# Altium schematic sheet FeedbackLoop.SchDoc: Sync Demod
size Tabloid; DocumentNumber: LM-003; Revision: 3.0; SheetNumber: 2; SheetTotal: 11
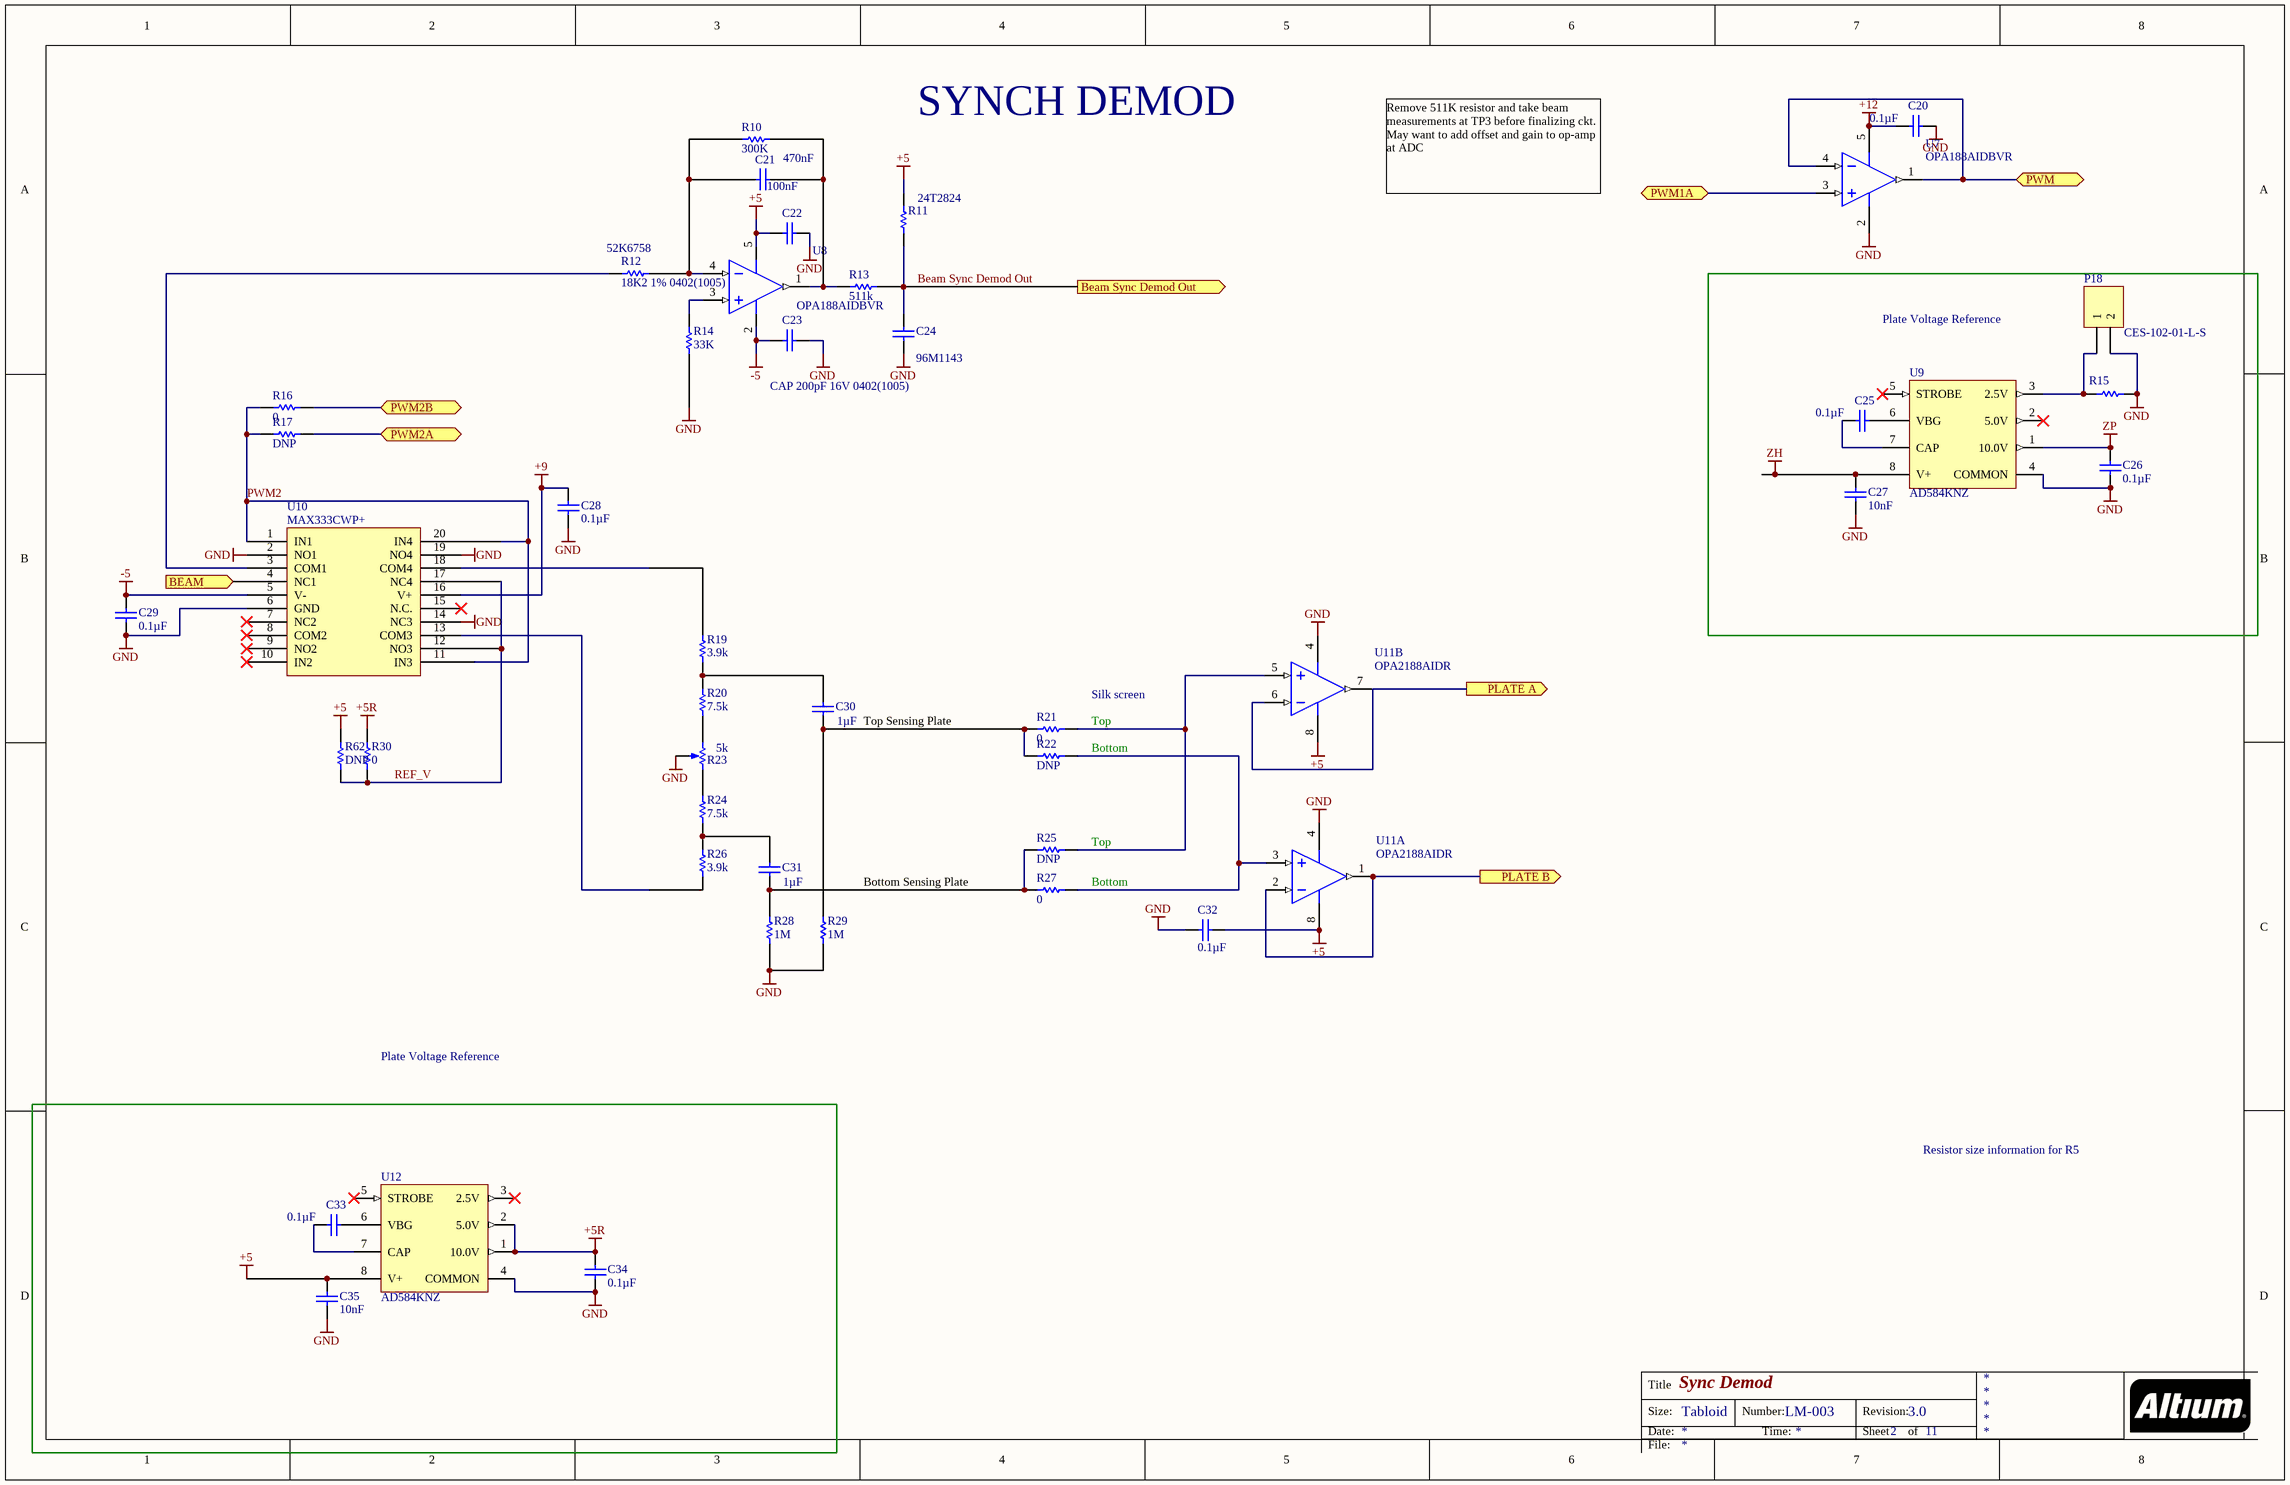
[diagram p0: FeedbackLoop.SchDoc]

## Parts
C20  Capacitance: 0.1µF  [CAPC0805(2012)100_N]  (hidden comment: CAP 100nF 25V 0805(2012))
C21  Capacitance: 470nF  [CAPC0402(1005)60_L]
C22  Capacitance: 100nF  [CAPC0402(1005)60_L]
C23  CAP 200pF 16V 0402(1005)  [CAPC0402(1005)60_L]
C24  Supplier Part Number 1: 96M1143  [CAPC0402(1005)60_L]
C25  Capacitance: 0.1µF  [CAPC0805(2012)100_N]  (hidden comment: CAP 100nF 25V 0805(2012))
C26  Capacitance: 0.1µF  [CAPC0805(2012)145_N]  (hidden comment: CAP CER 0.1UF 25V X7R 0805)
C27  Capacitance: 10nF  [CAPC0805(2012)145_N]  (hidden comment: Multilayer Ceramic Capacitors MLCC - SMD/SMT 0.01uF 50volts 10% X7R)
C28  Capacitance: 0.1µF  [CAPC0805(2012)145_N]  (hidden comment: CAP CER 0.1UF 25V X7R 0805)
C29  Capacitance: 0.1µF  [CAPC0805(2012)145_N]  (hidden comment: CAP CER 0.1UF 25V X7R 0805)
C30  Capacitance: 1µF  [CAPC0805(2012)155_L]  (hidden comment: CAP CER 1UF 25V X7R 0805)
C31  Capacitance: 1µF  [CAPC0805(2012)155_L]  (hidden comment: CAP CER 1UF 25V X7R 0805)
C32  Capacitance: 0.1µF  [CAPC0805(2012)155_L]  (hidden comment: CAP CER 0.1UF 25V X7R 0805)
C33  Capacitance: 0.1µF  [CAPC0805(2012)100_N]  (hidden comment: CAP 100nF 25V 0805(2012))
C34  Capacitance: 0.1µF  [CAPC0805(2012)145_N]  (hidden comment: CAP CER 0.1UF 25V X7R 0805)
C35  Capacitance: 10nF  [CAPC0805(2012)145_N]  (hidden comment: Multilayer Ceramic Capacitors MLCC - SMD/SMT 0.01uF 50volts 10% X7R)
P18  LOW PROFILE .025" SQUARE STRIPS  [CES-102-01-L-S]  (value not drawn)
R10  300K  [RESC0402(1005)_M]
R11  Supplier Part Number 1: 24T2824  [RESC0402(1005)_M]
R12  18K2 1% 0402(1005)  Supplier Part Number 1: 52K6758  [RESC0402(1005)_M]
R13  511k  [RESC0402(1005)_M]
R14  33K  [RESC0402(1005)_M]
R15  TBD  [VH102K]  (value not drawn)
R16  0  [RESC0402(1005)_M]
R17  DNP  [RESC0402(1005)_M]
R19  3.9k  [RESC0402(1005)_M]
R20  7.5k  [RESC0402(1005)_M]
R21  0  [RESC0402(1005)_M]
R22  DNP  [RESC0402(1005)_M]
R23  Resistance (Ohms): 5k  [Trimmer 2.54]  (hidden comment: TRIMMER 5K OHM 0.25W PC PIN)
R24  7.5k  [RESC0402(1005)_M]
R25  DNP  [RESC0402(1005)_M]
R26  3.9k  [RESC0402(1005)_M]
R27  0  [RESC0402(1005)_M]
R28  1M  [RESC0402(1005)_M]
R29  1M  [RESC0402(1005)_M]
R30  0  [RESC0402(1005)_M]
R62  DNP  [RESC0402(1005)_M]
U7  OPA188AIDBVR  [DBV0005A_M]
U8  OPA188AIDBVR  [DBV0005A_M]
U9  AD584KNZ  [ADI-N-8]
U10  MAX333CWP+  [TSOP65P640X90-20N]
U11  OPA2188AIDR  [D0008A_L]  (parts A,B of 2)
U12  AD584KNZ  [ADI-N-8]

## Blocks framed on the sheet
Plate Voltage Reference: C25-C27 P18 R15 U9

## Ports
BEAM (in), Beam Sync Demod Out (out), PLATE A (out), PLATE B (out), PWM, PWM1A, PWM2A, PWM2B

## Nets
+5: C22.1 C32.1 C35.1 R11.2 R62.2 U8.5(V+) U11.8(V+) U12.8(V+)
+5R: C34.1 R30.2 U12.1(10.0V) U12.2(5.0V)
+9: C28.2 U10.16(V+)
+12: C20.1 U7.5(V+)
-5: C23.1 C29.1 U8.2(V-) U10.5(V-)
GND: C20.2 C22.2 C23.2 C24.1 C26.2 C27.2 C28.1 C29.2 C32.2 C34.2 C35.2 P18.2 R14.1 R15.2 R23.2(b) R28.1 R29.1 U7.2(V-) U9.4(COMMON) U10.2(NO1) U10.6(GND) U10.14(NC3) U10.19(NO4) U11.4(V-) U12.4(COMMON)
ZH: C27.1 U9.8(V+)
ZP: C26.1 U9.1(10.0V)
BEAM: U10.4(NC1) ; port BEAM
Beam Sync Demod Out: C24.2 R11.1 R13.2 ; port Beam Sync Demod Out
PLATE A: U11.6(IN_B-) ; port PLATE A
PLATE B: U11.1(OUT_A) U11.2(IN_A-) ; port PLATE B
PWM: U7.1(OUT) U7.4(IN-) ; port PWM
PWM1A: U7.3(IN+) ; port PWM1A
PWM2: R16.2 R17.2 U10.1(IN1) U10.11(IN3) U10.20(IN4)
PWM2A: R17.1 ; port PWM2A
PWM2B: R16.1 ; port PWM2B
REF_V: R30.1 R62.1 U10.12(NO3) U10.17(NC4)
NetC21_1: C21.1 R10.1 R12.2 U8.4(IN-)
NetC21_2: C21.2 R10.2 R13.1 U8.1(OUT)
NetC25_1: C25.1 U9.7(CAP)
NetC25_2: C25.2 U9.6(VBG)
NetC30_1: C30.1 R21.2 R22.2 R29.2
NetC30_2: C30.2 R19.1 R20.2
NetC31_1: C31.1 R25.2 R27.2 R28.2
NetC31_2: C31.2 R24.1 R26.2
NetC33_1: C33.1 U12.7(CAP)
NetC33_2: C33.2 U12.6(VBG)
NetP18_1: P18.1 R15.1 U9.3(2.5V)
NetR12_1: R12.1 U10.3(COM1)
NetR14_2: R14.2 U8.3(IN+)
NetR19_2: R19.2 U10.18(COM4)
NetR20_1: R20.1 R23.3(c)
NetR21_1: R21.1 R25.1 U11.5(IN_B+)
NetR22_1: R22.1 R27.1 U11.3(IN_A+)
NetR23_1: R23.1(a) R24.2
NetR26_1: R26.1 U10.13(COM3)

Not connected (* = marked no-connect by the designer): U9 2(5.0V)* 5(STROBE)*; U10 7(NC2)* 8(COM2)* 9(NO2)* 10(IN2)* 15(N.C.)*; U11 7(OUT_B); U12 3(2.5V)* 5(STROBE)*

## Notes on the sheet
- SYNCH DEMOD
- Remove 511K resistor and take beam measurements at TP3 before finalizing ckt.
  May want to add offset and gain to op-amp at ADC
- Silk screen
- (near C30) Top Sensing Plate
- Top
- Bottom
- Bottom Sensing Plate
- (near R25) Top
- Plate Voltage Reference
- Resistor size information for R5
- Title
- Size:
- Date:
- Tabloid
- Number:
- Time:
- Revision:
- Sheet
- of
- File:

## Library data of the parts
C20 C25 C33 = CMP-1036-04416-1: CAP 100nF 25V -20% to +80% 0805 (2012 Metric) Thickness 1mm SMD; Manufacturer: Murata Electronics North America; Manufacturer Part Number: GRM21BR71E104KA01L; Tolerance: ±10%; Temperature Coefficient: X7R; Supplier 1: Digi-Key; Supplier Part Number 1: 490-1673-1-ND; RoHS: RoHS Compliant; Category: Capacitors; Stock 1: 895391; Pricing 1: 1=0.2, 10=0.145, 100=0.0683, 500=0.04788, 1000=0.03964 (USD); Packaging: Cut Tape (CT); Part Status: Active; Voltage - Rated: 25V; Operating Temperature: -55°C ~ 125°C; Features: -; Ratings: -; Applications: General Purpose; Mounting Type: Surface Mount, MLCC; Package / Case: 0805 (2012 Metric); Size / Dimension: 0.079" L x 0.049" W (2.00mm x 1.25mm); Height - Seated (Max): -; Thickness (Max): 0.053" (1.35mm); Lead Spacing: -; Lead Style: -; ComponentLink1URL: http://www.murata.com/~/media/webrenewal/support/library/catalog/products/capacitor/mlcc/c02e.ashx; ComponentLink1Description: http://www.murata.com/~/media/webrenewal/support/library/catalog/products/capacitor/mlcc/c02e.ashx
C21 = CMP-1034-01343-1: Manufacturer: TDK; Manufacturer Part Number: C1005X5R1E474M050BB; Dielectric Material: Ceramic; Tolerance: 20%; Voltage Rating: 25V; Dielectric: X5R; Supplier 1: Mouser; Supplier Part Number 1: 810-C1005X5R1E474M; Stock 1: 40105; Pricing 1: 1=0.15, 10=0.101, 50=0.101, 100=0.04, 1000=0.028, 10000=0.023 (USD); Mount: Surface Mount; Case/Package: 0402; Weight: 2.3E-05oz; Case Code (Metric): 1005; Case Code (Imperial): 0402; Min Operating Temperature: -55°C; Max Operating Temperature: 85°C; Package Quantity: 10000; Packaging: Tape and Reel; Voltage Rating (DC): 25V; Termination: SMD/SMT; Composition: Ceramic; Length: 1mm; Height: 0.5mm; Width: 0.02inch; Depth: 0.5mm; Thickness: 500um; Radiation Hardening: No; REACH SVHC: No SVHC; Lead Free: Lead Free; ComponentLink1URL: https://datasheet.ciiva.com/26870/getdatasheetpartid-753870-26870164.pdf; ComponentLink1Description: https://datasheet.ciiva.com/26870/getdatasheetpartid-753870-26870164.pdf; ComponentLink2URL: https://datasheet.ciiva.com/24219/mlcc-commercial-general-en-24219290.pdf; ComponentLink2Description: https://datasheet.ciiva.com/24219/mlcc-commercial-general-en-24219290.pdf
C22 = CMP-1034-01343-1: Manufacturer: Kemet; Manufacturer Part Number: C0402C104K4RACAUTO; Dielectric Material: Ceramic; Tolerance: 10%; Voltage Rating: 16V; Dielectric: X7R; Dissipation Factor: 3.5%; Supplier 1: Mouser; Supplier Part Number 1: 80-C0402C104K4RAUTO; Stock 1: 120173; Pricing 1: 1=0.1, 10=0.07, 50=0.07, 100=0.07, 1000=0.059, 10000=0.042 (USD); Mount: Surface Mount; Case/Package: 0402; Case Code (Imperial): 0402; Case Code (Metric): 1005; Min Operating Temperature: -55°C; Max Operating Temperature: 125°C; Packaging: Tape and Reel; Package Quantity: 10000; Voltage Rating (DC): 16V; Termination: SMD/SMT; Length: 1mm; Height: 0.5mm; Width: 0.5mm; Thickness: 0.022inch; Depth: 0.5mm; Radiation Hardening: No; REACH SVHC: No SVHC; ComponentLink1URL: https://datasheet.ciiva.com/6254/datasheetpn-c0402c104k4racauto-6254625.pdf; ComponentLink1Description: https://datasheet.ciiva.com/6254/datasheetpn-c0402c104k4racauto-6254625.pdf; ComponentLink2URL: https://datasheet.ciiva.com/5999/1730444-5999370.pdf; ComponentLink2Description: https://datasheet.ciiva.com/5999/1730444-5999370.pdf; ComponentLink3URL: https://datasheet.ciiva.com/7747/1730444-7747437.pdf; ComponentLink3Description: https://datasheet.ciiva.com/7747/1730444-7747437.pdf; ComponentLink4URL: https://datasheet.ciiva.com/22693/1730444-22693870.pdf; ComponentLink4Description: https://datasheet.ciiva.com/22693/1730444-22693870.pdf
C23 = CMP-1034-01343-1: CAP 200pF 16V ±2% 0402 (1005 Metric) Thickness 0.6mm SMD; Manufacturer: Kemet; Manufacturer Part Number: C0402C104K4RACAUTO; Case-EIA: 0402; Case-Metric: 1005; Tolerance: Â±2%; Dielectric Material: Ceramic; Capacitance: 100nF; Dielectric: X7R; Dissipation Factor: 3.5%; Value: 200pF; Technology: SMT; Rated Voltage: 16 V; Max Thickness: 0.6 mm; Supplier 1: Mouser; Supplier Part Number 1: 80-C0402C104K4RAUTO; Stock 1: 120173; Pricing 1: 1=0.1, 10=0.07, 50=0.07, 100=0.07, 1000=0.059, 10000=0.042 (USD); Mount: Surface Mount; Case/Package: 0402; Case Code (Imperial): 0402; Case Code (Metric): 1005; Min Operating Temperature: -55°C; Max Operating Temperature: 125°C; Voltage Rating: 16V; Packaging: Tape and Reel; Package Quantity: 10000; Voltage Rating (DC): 16V; Termination: SMD/SMT; Length: 1mm; Height: 0.5mm; Width: 0.5mm; Thickness: 0.022inch; Depth: 0.5mm; Radiation Hardening: No; REACH SVHC: No SVHC; ComponentLink1URL: https://datasheet.ciiva.com/6254/datasheetpn-c0402c104k4racauto-6254625.pdf; ComponentLink1Description: https://datasheet.ciiva.com/6254/datasheetpn-c0402c104k4racauto-6254625.pdf; ComponentLink2URL: https://datasheet.ciiva.com/5999/1730444-5999370.pdf; ComponentLink2Description: https://datasheet.ciiva.com/5999/1730444-5999370.pdf; ComponentLink3URL: https://datasheet.ciiva.com/7747/1730444-7747437.pdf; ComponentLink3Description: https://datasheet.ciiva.com/7747/1730444-7747437.pdf; ComponentLink4URL: https://datasheet.ciiva.com/22693/1730444-22693870.pdf; ComponentLink4Description: https://datasheet.ciiva.com/22693/1730444-22693870.pdf
C24 = CMP-1034-01343-1: Manufacturer: AVX; Manufacturer Part Number: 04025A220JAT2A; Ceramic Capacitor Case: 0402 [1005 Metric]; Capacitance: 22; Voltage Rating: 50; Capacitance Tolerance: 5%; Dielectric Characteristic: C0G / NP0; Supplier 1: Newark; RoHS: YES; Stock 1: 239391; Pricing 1: 1=0.003, 25=0.003, 100=0.003, 250=0.003, 500=0.003, 1000=0.003, 2500=0.003 (USD); Product Range: -; Packaging: Cut Tape; ComponentLink1URL: http://www.farnell.com/datasheets/2068140.pdf; ComponentLink1Description: http://www.farnell.com/datasheets/2068140.pdf
C26 C28 C29 C34 = CMP-1036-04795-1: Manufacturer: Murata Electronics North America; Manufacturer Part Number: GRM21BR71E104KA01L; Tolerance: ±10%; Supplier 1: Digi-Key; Supplier Part Number 1: 490-1673-6-ND; RoHS: RoHS Compliant; Category: Capacitors; Stock 1: 891652; Pricing 1: 1=0.2, 10=0.145, 100=0.0683, 500=0.04788, 1000=0.03964 (USD); Packaging: Digi-Reel®; Part Status: Active; Voltage - Rated: 25V; Temperature Coefficient: X7R; Operating Temperature: -55°C ~ 125°C; Features: -; Ratings: -; Applications: General Purpose; Mounting Type: Surface Mount, MLCC; Package / Case: 0805 (2012 Metric); Size / Dimension: 0.079" L x 0.049" W (2.00mm x 1.25mm); Height - Seated (Max): -; Thickness (Max): 0.053" (1.35mm); Lead Spacing: -; Lead Style: -; ComponentLink1URL: http://www.murata.com/~/media/webrenewal/support/library/catalog/products/capacitor/mlcc/c02e.ashx; ComponentLink1Description: http://www.murata.com/~/media/webrenewal/support/library/catalog/products/capacitor/mlcc/c02e.ashx
C27 C35 = CMP-1036-04795-1: Manufacturer: Kemet; Manufacturer Part Number: C0805C103K5RACAUTO; Voltage Rating: 50V; Supplier 1: Digi-Key; Supplier Part Number 1: 399-6924-1-ND; Stock 1: 63236; Pricing 1: 1=0.12, 10=0.087, 100=0.041, 500=0.0287, 1000=0.0238 (USD); Mount: Surface Mount; Case/Package: 0805; Case Code (Metric): 2012; Case Code (Imperial): 0805; Dielectric Material: Ceramic; Contact Plating: Tin; Min Operating Temperature: -55°C; Max Operating Temperature: 125°C; Tolerance: 10%; Packaging: Tape and Reel; Package Quantity: 1; Voltage Rating (DC): 50V; Dielectric: X7R; Termination: SMD/SMT; Length: 2mm; Height: 0.78mm; Width: 0.049inch; Thickness: 0.035inch; Depth: 1.25mm; Radiation Hardening: No; REACH SVHC: No SVHC; ComponentLink1URL: https://datasheet.ciiva.com/22700/1693454-22700519.pdf; ComponentLink1Description: https://datasheet.ciiva.com/22700/1693454-22700519.pdf; ComponentLink2URL: https://datasheet.ciiva.com/7842/1693454-7842175.pdf; ComponentLink2Description: https://datasheet.ciiva.com/7842/1693454-7842175.pdf
C30 C31 = CMP-1036-04882-1: Manufacturer: Murata Electronics North America; Manufacturer Part Number: GRM21BR71E105KA99L; Tolerance: ±10%; Supplier 1: Digi-Key; Supplier Part Number 1: 490-6484-6-ND; RoHS: RoHS Compliant; Category: Capacitors; Stock 1: 295074; Pricing 1: 1=0.14, 10=0.099, 100=0.0468, 500=0.0328, 1000=0.02715 (USD); Packaging: Digi-Reel®; Part Status: Active; Voltage - Rated: 25V; Temperature Coefficient: X7R; Operating Temperature: -55°C ~ 125°C; Features: -; Ratings: -; Applications: General Purpose; Mounting Type: Surface Mount, MLCC; Package / Case: 0805 (2012 Metric); Size / Dimension: 0.079" L x 0.049" W (2.00mm x 1.25mm); Height - Seated (Max): -; Thickness (Max): 0.053" (1.35mm); Lead Spacing: -; Lead Style: -; ComponentLink1URL: http://www.murata.com/~/media/webrenewal/support/library/catalog/products/capacitor/mlcc/c02e.ashx; ComponentLink1Description: http://www.murata.com/~/media/webrenewal/support/library/catalog/products/capacitor/mlcc/c02e.ashx
C32 = CMP-1036-04882-1: Manufacturer: Murata Electronics North America; Manufacturer Part Number: GRM21BR71E104KA01L; Tolerance: ±10%; Supplier 1: Digi-Key; Supplier Part Number 1: 490-1673-6-ND; RoHS: RoHS Compliant; Category: Capacitors; Stock 1: 891652; Pricing 1: 1=0.2, 10=0.145, 100=0.0683, 500=0.04788, 1000=0.03964 (USD); Packaging: Digi-Reel®; Part Status: Active; Voltage - Rated: 25V; Temperature Coefficient: X7R; Operating Temperature: -55°C ~ 125°C; Features: -; Ratings: -; Applications: General Purpose; Mounting Type: Surface Mount, MLCC; Package / Case: 0805 (2012 Metric); Size / Dimension: 0.079" L x 0.049" W (2.00mm x 1.25mm); Height - Seated (Max): -; Thickness (Max): 0.053" (1.35mm); Lead Spacing: -; Lead Style: -; ComponentLink1URL: http://www.murata.com/~/media/webrenewal/support/library/catalog/products/capacitor/mlcc/c02e.ashx; ComponentLink1Description: http://www.murata.com/~/media/webrenewal/support/library/catalog/products/capacitor/mlcc/c02e.ashx
P18 = Header 2: Manufacturer: Samtec Inc.; Connector Type: Receptacle; Style: Board to Board; Number of Positions: 2; Number of Positions Loaded: All; Pitch - Mating: 0.100" (2.54mm); Contact Length - Post: 0.128" (3.25mm); Material Flammability Rating: UL94 V-0; Supplier 1: Digi-Key; Supplier Part Number 1: CES-102-01-L-S-ND; Manufacturer Part Number: CES-102-01-L-S; RoHS: RoHS Compliant; Category: Connectors, Interconnects; Stock 1: 0; Pricing 1: 1=0.61 (USD); Packaging: Bulk; Part Status: Active; Contact Type: Female Socket; Number of Rows: 1; Row Spacing - Mating: -; Mounting Type: Through Hole; Termination: Solder; Fastening Type: Push-Pull; Contact Finish - Mating: Gold; Contact Finish Thickness - Mating: 10µin (0.25µm); Insulation Color: Black; Insulation Height: 0.200" (5.08mm); Operating Temperature: -55°C ~ 125°C; Contact Finish - Post: Tin; Mated Stacking Heights: -; Ingress Protection: -; Features: -; Current Rating: -; Voltage Rating: -; Applications: -; Insulation Material: Polybutylene Terephthalate (PBT); Contact Shape: Square; Contact Material: Phosphor Bronze; Contact Finish Thickness - Post: -; ComponentLink1URL: http://suddendocs.samtec.com/prints/ces-1xx-xx-x-s-xx-mkt.pdf; ComponentLink1Description: http://suddendocs.samtec.com/prints/ces-1xx-xx-x-s-xx-mkt.pdf
R10 R13 R14 R16 R17 R19-R22 R24-R30 R62 = CMP-1011-00651-1
R11 = CMP-1011-00651-1: Manufacturer: VISHAY; Manufacturer Part Number: CRCW0402100KFKEDHP; Supplier 1: Newark; Stock 1: 0; Pricing 1: 10000=0.014, 20000=0.012 (USD); ComponentLink1URL: http://www.farnell.com/datasheets/2140397.pdf; ComponentLink1Description: http://www.farnell.com/datasheets/2140397.pdf
R12 = CMP-1011-00651-1: 18K2 0.063W 1% 0402 (1005 Metric)  SMD; Manufacturer: VISHAY; Manufacturer Part Number: CRCW040218K2FKED; Resistance: 18.2; Voltage Rating: 50; Resistor Case Style: 0402 [1005 Metric]; Power Rating: 63; Product Range: CRCW Series; No. of Pins: 2; Supplier 1: Newark; RoHS: YESX; Stock 1: 9263; Pricing 1: 1=0.004, 25=0.004, 100=0.004, 250=0.004, 500=0.004, 1000=0.004 (USD); Resistance Tolerance: 1%; Packaging: Cut Tape; ComponentLink1URL: http://www.vishay.com/docs/31543/packsmre.pdf; ComponentLink1Description: http://www.vishay.com/docs/31543/packsmre.pdf; ComponentLink2URL: http://www.farnell.com/cad/1551401.zip; ComponentLink2Description: http://www.farnell.com/cad/1551401.zip; ComponentLink3URL: http://www.farnell.com/datasheets/2111203.pdf?_ga=1.39057253.733356815.1493180800; ComponentLink3Description: http://www.farnell.com/datasheets/2111203.pdf?_ga=1.39057253.733356815.1493180800
R15 = CMP-1013-00393-1
R23 = Trimmer: Manufacturer: Vishay Foil Resistors (Division of Vishay Precision Group); Manufacturer Part Number: Y00535K00000J0L; Power (Watts): 0.25W, 1/4W; Tolerance: ±5%; Temperature Coefficient: ±10ppm/°C; Number of Turns: 21; Adjustment Type: Side Adjustment; Resistive Material: Metal Foil; Supplier 1: Digi-Key; Supplier Part Number 1: 804-1020-ND; RoHS: RoHS Compliant; Category: Potentiometers, Variable Resistors; Stock 1: 679; Pricing 1: 1=34.42, 10=32.265, 25=26.5292, 50=22.944, 100=22.227, 250=20.793, 500=19.2156 (USD); Packaging: Bulk; Part Status: Active; Mounting Type: Through Hole; Termination Style: PC Pins; Size / Dimension: Rectangular - 0.250" x 0.175" Face x 0.250" L (6.35mm x 4.45mm x 6.35mm); ComponentLink1URL: http://www.vishaypg.com/docs/63053/1240.pdf; ComponentLink1Description: http://www.vishaypg.com/docs/63053/1240.pdf
U7 U8 = CMP-0809-00005-2: Precision, Low Noise, Rail-to-Rail Output, Zero-Drift Operational Amplifier, 4 to 36 V, -40 to 125 degC, 5-pin SOT23 (DBV5), Green (RoHS & no Sb/Br); Manufacturer: Texas Instruments; Total Supply Voltage(Min)(+5V is 5, +/-5V is 10): 4; Offset Drift(Typ)(uV/C): 0.03; Rating: Catalog; SubFamily: Zero Drift Precision Amplifier; GBW(Typ)(MHz): 2; Slew Rate(Typ)(V/us): 0.8; Number of Channels: 1; CMRR(Min)(dB): 120; Iq per channel(Max)(mA): 0.51; Total Supply Voltage(Max)(+5V is 5, +/-5V is 10): 36; PartNumber: OPA188AIDBVR; ComponentLink2Description: Datasheet; ComponentLink2URL: http://www.ti.com/lit/ds/symlink/opa188.pdf; ComponentLink1Description: Manufacturer URL; Mounting Technology: Surface Mount; Eco-Plan: Green (RoHS & no Sb/Br); ComponentLink1URL: http://www.ti.com/; PackageVersion: 4073253-4/K, 03/2006; DatasheetVersion: SBOS642A; ComponentLink3Description: Package Specification; PackageReference: DBV0005A; ComponentLink3URL: http://www.ti.com/litv/pdf/mpds018i; PackageDescription: 5-Pin Plastic Small Outline, Body 1.6 x 2.9 mm, Pitch 0.95 mm; Code_JEDEC: MO-178
U9 U12 = CMP-0784-00054-1: Pin Programmable, Precision Voltage Reference, + 2.5 / + 5 / + 7.5 / + 10 Prog V Output, 4.5 to 30 V Supply, Commercial, 8-pin DIP (N-8), Tube; Manufacturer: Analog Devices; Max V Supply (V): 30; Min V Supply (V): 4.5; Ref Out TC (ppm/C): 15; Vout: 2.5V, 5V, 7.5V, 10V; ComponentLink3URL: http:/www.analog.com/static/imported-files/packages/PKG_PDF/PDIP(N)/N_8.pdf; ComponentLink1URL: http://www.analog.com/en/index.html; PartNumber: AD584KNZ; ComponentLink1Description: Manufacturer URL; ComponentLink2Description: Datasheet; PackageDescription: 8-Pin Plastic Dual In-Line Package, Row spacing 7.62 mm, Pitch 2.54 mm; Operating Temp Range: 0 to 70 degC; DatasheetVersion: Rev. C; Code_JEDEC: MS-001; Packing: Tube; ComponentLink3Description: Package Specification; PackageReference: N-8; ComponentLink4Description: URL Link1; Mounting Technology: Through Hole; PackageVersion: 070606-A, 07/2006; ComponentLink4URL: Product URL:http://www.analog.com/en/special-linear-functions/voltage-references/ad584/products/product.html; ComponentLink2URL: http://www.analog.com/static/imported-files/data_sheets/AD584.pdf
U10 = MAX333CWP+: IC SWITCH QUAD SPDT 20TSSOP; Manufacturer: Maxim; Manufacturer Part Number: MAX333AEUP+; Max Supply Voltage: 30V; Min Supply Voltage: 10V; Min Dual Supply Voltage: 4.5V; Max Dual Supply Voltage: 20V; On-State Resistance: 35R; Operating Supply Current: 1uA; Supply Type: Single,Dual; Max Power Dissipation: 559mW; Turn-On Delay Time: 175ns; Turn-Off Delay Time: 145ns; Max Supply Current: 250uA; Number of Bits: 4; Dual Supply Voltage: 15V; Supplier 1: Mouser; Supplier Part Number 1: 700-MAX333AEUP; Stock 1: 664; Pricing 1: 1=6.77, 10=6.43, 50=5.8, 100=5.8, 1000=5.62, 10000=5.62 (USD); Case/Package: TSSOP; Number of Pins: 20; Weight: 0.006737oz; Min Operating Temperature: -40°C; Max Operating Temperature: 85°C; Packaging: Rail/Tube; Package Quantity: 74; Throw Configuration: SPDT; Number of Channels: 4; Length: 6.6mm; Height: 0.95mm; Width: 4.5mm; Radiation Hardening: No; Lead Free: Lead Free; REACH SVHC: Unknown; ComponentLink1URL: https://datasheet.ciiva.com/2978/max333a-2978850.pdf; ComponentLink1Description: https://datasheet.ciiva.com/2978/max333a-2978850.pdf; ComponentLink2URL: https://datasheet.ciiva.com/30478/0900766b81253c85-30478260.pdf; ComponentLink2Description: https://datasheet.ciiva.com/30478/0900766b81253c85-30478260.pdf; ComponentLink3URL: https://datasheet.ciiva.com/1674/max333a-1674617.pdf; ComponentLink3Description: https://datasheet.ciiva.com/1674/max333a-1674617.pdf; ComponentLink4URL: https://datasheet.ciiva.com/26825/max333aeup-26825546.pdf; ComponentLink4Description: https://datasheet.ciiva.com/26825/max333aeup-26825546.pdf
U11 = CMP-0272-00241-3: 0.03 uV/degC, 6 uV Vos, Low Noise, Rail-to-Rail Output, Zero-Drift Operational Amplifier, 4 to 36 V, -40 to 105 degC, 8-pin SOIC (D8), Green (RoHS & no Sb/Br); Manufacturer: Texas Instruments; Number of Circuits: 2; Slew Rate: 0.8 V/µs; Current - Supply: 415µA; Current - Output / Channel: 18mA; Voltage - Supply, Single/Dual (±): 4 V ~ 36 V, ±2 V ~ 18 V; Supplier 1: Digi-Key; Supplier Part Number 1: 296-29454-6-ND; Manufacturer Part Number: OPA2188AIDR; RoHS: RoHS Compliant; Category: Integrated Circuits (ICs); Stock 1: 8272; Pricing 1: 1=3.44, 10=3.089, 100=2.5307, 500=2.15434, 1000=1.81692 (USD); Packaging: Digi-Reel®; Part Status: Active; Amplifier Type: Zero-Drift; Output Type: Rail-to-Rail; -3db Bandwidth: -; Operating Temperature: -40°C ~ 105°C; Mounting Type: Surface Mount; Package / Case: 8-SOIC (0.154", 3.90mm Width); Supplier Device Package: 8-SOIC; ComponentLink1URL: http://www.ti.com/lit/ds/symlink/opa2188.pdf; ComponentLink1Description: http://www.ti.com/lit/ds/symlink/opa2188.pdf